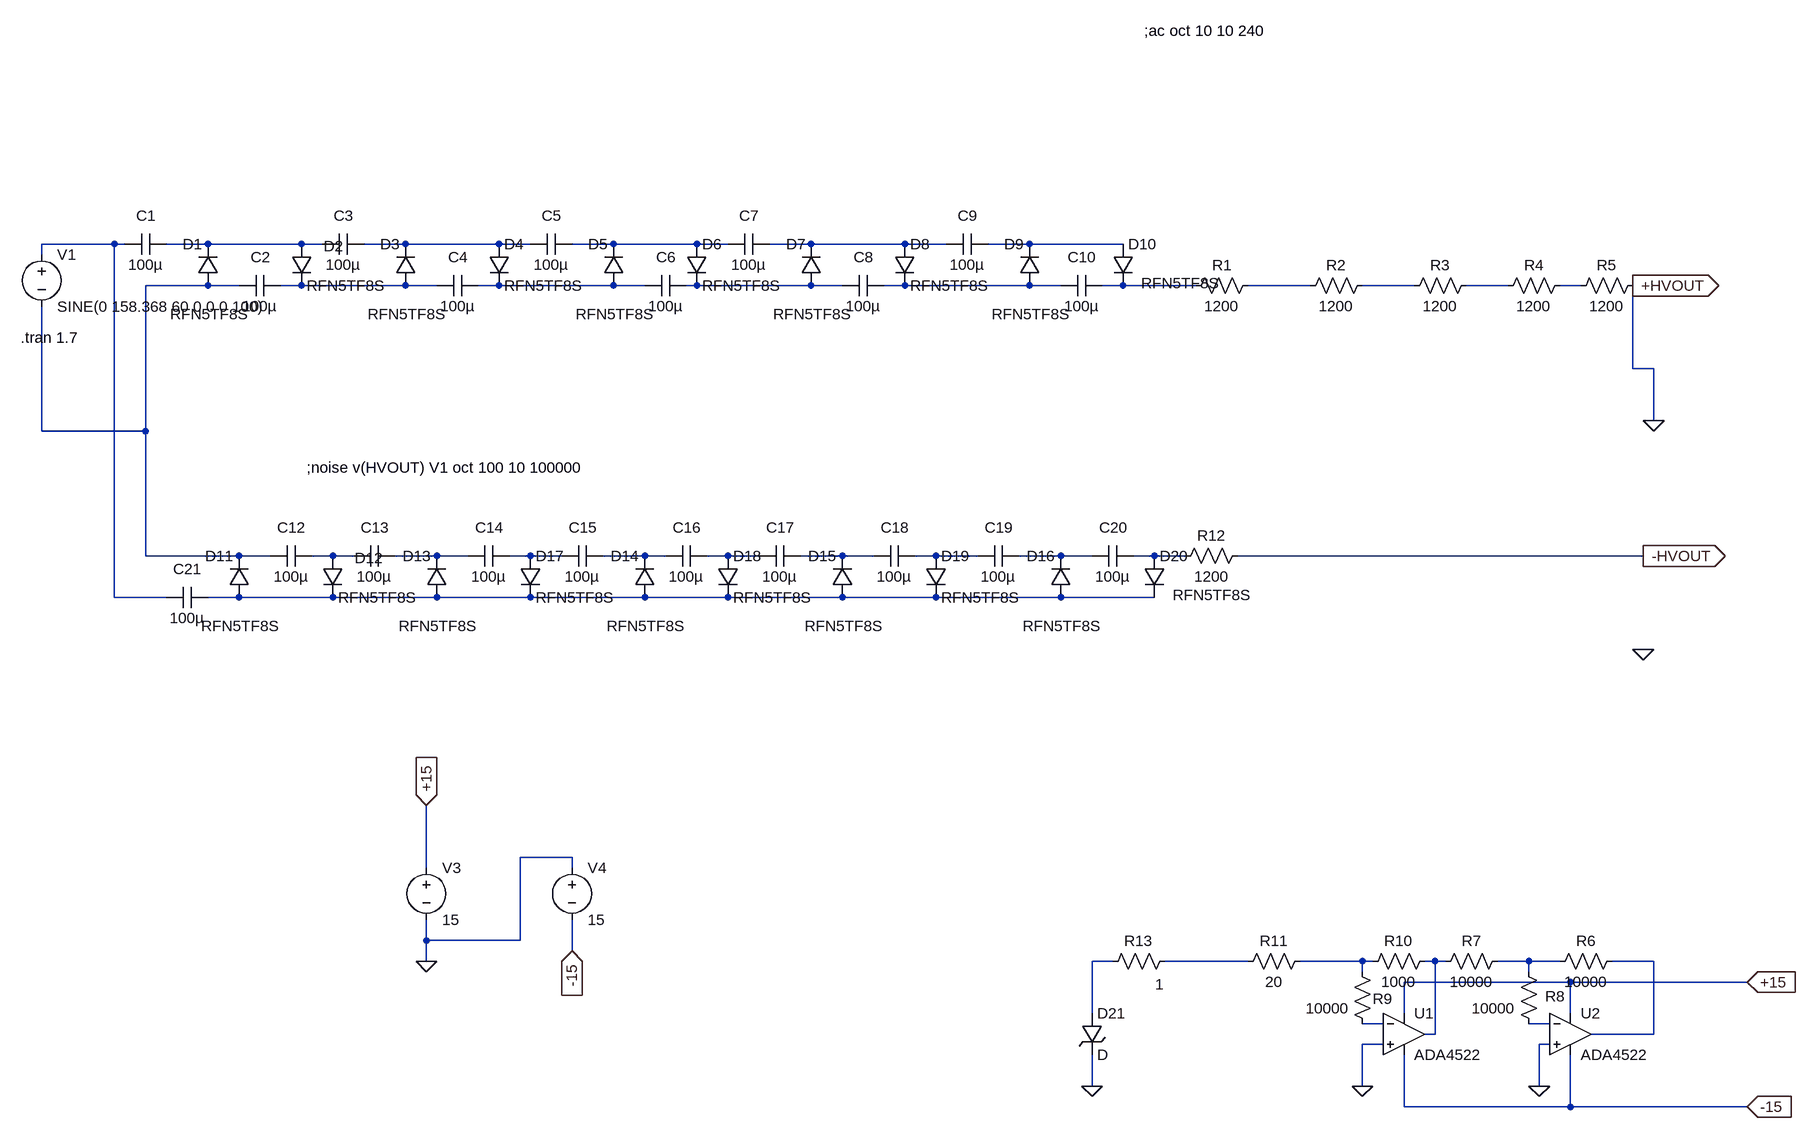
[diagram p0: schematic WALTON COCKROFT MULTIPLIER rev2.asc]
WALTON COCKROFT MULTIPLIER rev2.asc, the LTspice schematic file:
Version 4
SHEET 1 2644 1512
WIRE 32 112 -80 112
WIRE 48 112 32 112
WIRE 176 112 112 112
WIRE 320 112 176 112
WIRE 352 112 320 112
WIRE 480 112 416 112
WIRE 624 112 480 112
WIRE 672 112 624 112
WIRE 800 112 736 112
WIRE 928 112 800 112
WIRE 976 112 928 112
WIRE 1104 112 1040 112
WIRE 1248 112 1104 112
WIRE 1312 112 1248 112
WIRE 1440 112 1376 112
WIRE 1584 112 1440 112
WIRE -80 128 -80 112
WIRE 176 176 80 176
WIRE 224 176 176 176
WIRE 320 176 288 176
WIRE 480 176 320 176
WIRE 528 176 480 176
WIRE 624 176 592 176
WIRE 800 176 624 176
WIRE 848 176 800 176
WIRE 928 176 912 176
WIRE 1104 176 928 176
WIRE 1152 176 1104 176
WIRE 1248 176 1216 176
WIRE 1440 176 1248 176
WIRE 1488 176 1440 176
WIRE 1584 176 1552 176
WIRE 1696 176 1584 176
WIRE 1872 176 1776 176
WIRE 2032 176 1952 176
WIRE 2176 176 2112 176
WIRE 2288 176 2256 176
WIRE 2368 304 2368 176
WIRE 2400 304 2368 304
WIRE 2400 384 2400 304
WIRE -80 400 -80 208
WIRE 80 400 80 176
WIRE 80 400 -80 400
WIRE 80 592 80 400
WIRE 224 592 80 592
WIRE 272 592 224 592
WIRE 368 592 336 592
WIRE 400 592 368 592
WIRE 528 592 464 592
WIRE 576 592 528 592
WIRE 672 592 640 592
WIRE 720 592 672 592
WIRE 848 592 784 592
WIRE 880 592 848 592
WIRE 976 592 944 592
WIRE 1024 592 976 592
WIRE 1152 592 1088 592
WIRE 1200 592 1152 592
WIRE 1296 592 1264 592
WIRE 1360 592 1296 592
WIRE 1488 592 1424 592
WIRE 1536 592 1488 592
WIRE 1632 592 1600 592
WIRE 1680 592 1632 592
WIRE 2384 592 1760 592
WIRE 32 656 32 112
WIRE 112 656 32 656
WIRE 224 656 176 656
WIRE 368 656 224 656
WIRE 528 656 368 656
WIRE 672 656 528 656
WIRE 848 656 672 656
WIRE 976 656 848 656
WIRE 1152 656 976 656
WIRE 1296 656 1152 656
WIRE 1488 656 1296 656
WIRE 1632 656 1488 656
WIRE 736 1056 656 1056
WIRE 512 1072 512 976
WIRE 736 1072 736 1056
WIRE 512 1184 512 1152
WIRE 656 1184 656 1056
WIRE 656 1184 512 1184
WIRE 736 1200 736 1152
WIRE 512 1216 512 1184
WIRE 1568 1216 1536 1216
WIRE 1776 1216 1648 1216
WIRE 1952 1216 1856 1216
WIRE 1968 1216 1952 1216
WIRE 2064 1216 2048 1216
WIRE 2080 1216 2064 1216
WIRE 2208 1216 2160 1216
WIRE 2256 1216 2208 1216
WIRE 2400 1216 2336 1216
WIRE 1952 1232 1952 1216
WIRE 2208 1232 2208 1216
WIRE 2272 1248 2016 1248
WIRE 2544 1248 2272 1248
WIRE 1536 1296 1536 1216
WIRE 2016 1296 2016 1248
WIRE 2272 1296 2272 1248
WIRE 1984 1312 1952 1312
WIRE 2240 1312 2208 1312
WIRE 2064 1328 2064 1216
WIRE 2064 1328 2048 1328
WIRE 2400 1328 2400 1216
WIRE 2400 1328 2304 1328
WIRE 1984 1344 1952 1344
WIRE 2240 1344 2224 1344
WIRE 1536 1408 1536 1360
WIRE 1952 1408 1952 1344
WIRE 2224 1408 2224 1344
WIRE 2016 1440 2016 1360
WIRE 2272 1440 2272 1360
WIRE 2272 1440 2016 1440
WIRE 2544 1440 2272 1440
FLAG 2368 176 +HVOUT
IOPIN 2368 176 Out
FLAG 2400 384 0
FLAG 2384 592 -HVOUT
IOPIN 2384 592 Out
FLAG 2384 736 0
FLAG 2224 1408 0
FLAG 1952 1408 0
FLAG 1536 1408 0
FLAG 2544 1248 +15
IOPIN 2544 1248 In
FLAG 2544 1440 -15
IOPIN 2544 1440 In
FLAG 512 1216 0
FLAG 512 976 +15
IOPIN 512 976 In
FLAG 736 1200 -15
IOPIN 736 1200 In
SYMBOL cap 112 96 R90
WINDOW 0 -12 31 VBottom 2
WINDOW 3 32 32 VTop 2
SYMATTR InstName C1
SYMATTR Value 100µ
SYMATTR SpiceLine V=500 Irms=0 Rser=0.720 Lser=0
SYMBOL diode 192 176 R180
WINDOW 0 24 64 Left 2
WINDOW 3 -48 -44 Left 2
SYMATTR InstName D1
SYMATTR Value RFN5TF8S
SYMBOL cap 288 160 R90
WINDOW 0 -12 31 VBottom 2
WINDOW 3 32 32 VTop 2
SYMATTR InstName C2
SYMATTR Value 100µ
SYMATTR SpiceLine V=500 Irms=0 Rser=0.720 Lser=0
SYMBOL diode 304 112 R0
WINDOW 0 50 3 Left 2
SYMATTR InstName D2
SYMATTR Value RFN5TF8S
SYMBOL cap 416 96 R90
WINDOW 0 -12 31 VBottom 2
WINDOW 3 32 32 VTop 2
SYMATTR InstName C3
SYMATTR Value 100µ
SYMATTR SpiceLine V=500 Irms=0 Rser=0.720 Lser=0
SYMBOL diode 496 176 R180
WINDOW 0 24 64 Left 2
WINDOW 3 -48 -44 Left 2
SYMATTR InstName D3
SYMATTR Value RFN5TF8S
SYMBOL cap 592 160 R90
WINDOW 0 -12 31 VBottom 2
WINDOW 3 32 32 VTop 2
SYMATTR InstName C4
SYMATTR Value 100µ
SYMATTR SpiceLine V=500 Irms=0 Rser=0.720 Lser=0
SYMBOL cap 736 96 R90
WINDOW 0 -12 31 VBottom 2
WINDOW 3 32 32 VTop 2
SYMATTR InstName C5
SYMATTR Value 100µ
SYMATTR SpiceLine V=500 Irms=0 Rser=0.720 Lser=0
SYMBOL diode 816 176 R180
WINDOW 0 24 64 Left 2
WINDOW 3 -48 -44 Left 2
SYMATTR InstName D5
SYMATTR Value RFN5TF8S
SYMBOL cap 912 160 R90
WINDOW 0 -12 31 VBottom 2
WINDOW 3 32 32 VTop 2
SYMATTR InstName C6
SYMATTR Value 100µ
SYMATTR SpiceLine V=500 Irms=0 Rser=0.720 Lser=0
SYMBOL cap 1040 96 R90
WINDOW 0 -12 31 VBottom 2
WINDOW 3 32 32 VTop 2
SYMATTR InstName C7
SYMATTR Value 100µ
SYMATTR SpiceLine V=500 Irms=0 Rser=0.720 Lser=0
SYMBOL diode 1120 176 R180
WINDOW 0 24 64 Left 2
WINDOW 3 -48 -44 Left 2
SYMATTR InstName D7
SYMATTR Value RFN5TF8S
SYMBOL cap 1216 160 R90
WINDOW 0 -12 31 VBottom 2
WINDOW 3 32 32 VTop 2
SYMATTR InstName C8
SYMATTR Value 100µ
SYMATTR SpiceLine V=500 Irms=0 Rser=0.720 Lser=0
SYMBOL cap 1376 96 R90
WINDOW 0 -12 31 VBottom 2
WINDOW 3 32 32 VTop 2
SYMATTR InstName C9
SYMATTR Value 100µ
SYMATTR SpiceLine V=500 Irms=0 Rser=0.720 Lser=0
SYMBOL diode 1456 176 R180
WINDOW 0 24 64 Left 2
WINDOW 3 -48 -44 Left 2
SYMATTR InstName D9
SYMATTR Value RFN5TF8S
SYMBOL cap 1552 160 R90
WINDOW 0 -12 31 VBottom 2
WINDOW 3 32 32 VTop 2
SYMATTR InstName C10
SYMATTR Value 100µ
SYMATTR SpiceLine V=500 Irms=0 Rser=0.720 Lser=0
SYMBOL res 1792 160 R90
WINDOW 0 0 56 VBottom 2
WINDOW 3 32 56 VTop 2
SYMATTR InstName R1
SYMATTR Value 1200
SYMATTR SpiceLine pwr=5
SYMBOL res 1968 160 R90
WINDOW 0 0 56 VBottom 2
WINDOW 3 32 56 VTop 2
SYMATTR InstName R2
SYMATTR Value 1200
SYMATTR SpiceLine pwr=5
SYMBOL res 2128 160 R90
WINDOW 0 0 56 VBottom 2
WINDOW 3 32 56 VTop 2
SYMATTR InstName R3
SYMATTR Value 1200
SYMATTR SpiceLine pwr=5
SYMBOL res 2272 160 R90
WINDOW 0 0 56 VBottom 2
WINDOW 3 32 56 VTop 2
SYMATTR InstName R4
SYMATTR Value 1200
SYMATTR SpiceLine pwr=5
SYMBOL res 2384 160 R90
WINDOW 0 0 56 VBottom 2
WINDOW 3 32 56 VTop 2
SYMATTR InstName R5
SYMATTR Value 1200
SYMATTR SpiceLine pwr=5
SYMBOL voltage -80 112 R0
WINDOW 123 0 0 Left 2
WINDOW 39 0 0 Left 2
SYMATTR InstName V1
SYMATTR Value SINE(0 158.368 60 0 0 0 100)
SYMBOL diode 608 112 R0
SYMATTR InstName D4
SYMATTR Value RFN5TF8S
SYMBOL diode 912 112 R0
SYMATTR InstName D6
SYMATTR Value RFN5TF8S
SYMBOL diode 1232 112 R0
SYMATTR InstName D8
SYMATTR Value RFN5TF8S
SYMBOL diode 1568 112 R0
WINDOW 3 44 60 Left 2
SYMATTR Value RFN5TF8S
SYMATTR InstName D10
SYMBOL diode 240 656 R180
WINDOW 0 24 64 Left 2
WINDOW 3 -48 -44 Left 2
SYMATTR InstName D11
SYMATTR Value RFN5TF8S
SYMBOL cap 336 576 R90
WINDOW 0 -12 31 VBottom 2
WINDOW 3 32 32 VTop 2
SYMATTR InstName C12
SYMATTR Value 100µ
SYMATTR SpiceLine V=500 Irms=0 Rser=0.720 Lser=0
SYMBOL diode 352 592 R0
WINDOW 0 50 3 Left 2
SYMATTR InstName D12
SYMATTR Value RFN5TF8S
SYMBOL cap 464 576 R90
WINDOW 0 -12 31 VBottom 2
WINDOW 3 32 32 VTop 2
SYMATTR InstName C13
SYMATTR Value 100µ
SYMATTR SpiceLine V=500 Irms=0 Rser=0.720 Lser=0
SYMBOL diode 544 656 R180
WINDOW 0 24 64 Left 2
WINDOW 3 -48 -44 Left 2
SYMATTR InstName D13
SYMATTR Value RFN5TF8S
SYMBOL cap 640 576 R90
WINDOW 0 -12 31 VBottom 2
WINDOW 3 32 32 VTop 2
SYMATTR InstName C14
SYMATTR Value 100µ
SYMATTR SpiceLine V=500 Irms=0 Rser=0.720 Lser=0
SYMBOL cap 784 576 R90
WINDOW 0 -12 31 VBottom 2
WINDOW 3 32 32 VTop 2
SYMATTR InstName C15
SYMATTR Value 100µ
SYMATTR SpiceLine V=500 Irms=0 Rser=0.720 Lser=0
SYMBOL diode 864 656 R180
WINDOW 0 24 64 Left 2
WINDOW 3 -48 -44 Left 2
SYMATTR InstName D14
SYMATTR Value RFN5TF8S
SYMBOL cap 944 576 R90
WINDOW 0 -12 31 VBottom 2
WINDOW 3 32 32 VTop 2
SYMATTR InstName C16
SYMATTR Value 100µ
SYMATTR SpiceLine V=500 Irms=0 Rser=0.720 Lser=0
SYMBOL cap 1088 576 R90
WINDOW 0 -12 31 VBottom 2
WINDOW 3 32 32 VTop 2
SYMATTR InstName C17
SYMATTR Value 100µ
SYMATTR SpiceLine V=500 Irms=0 Rser=0.720 Lser=0
SYMBOL diode 1168 656 R180
WINDOW 0 24 64 Left 2
WINDOW 3 -48 -44 Left 2
SYMATTR InstName D15
SYMATTR Value RFN5TF8S
SYMBOL cap 1264 576 R90
WINDOW 0 -12 31 VBottom 2
WINDOW 3 32 32 VTop 2
SYMATTR InstName C18
SYMATTR Value 100µ
SYMATTR SpiceLine V=500 Irms=0 Rser=0.720 Lser=0
SYMBOL cap 1424 576 R90
WINDOW 0 -12 31 VBottom 2
WINDOW 3 32 32 VTop 2
SYMATTR InstName C19
SYMATTR Value 100µ
SYMATTR SpiceLine V=500 Irms=0 Rser=0.720 Lser=0
SYMBOL diode 1504 656 R180
WINDOW 0 24 64 Left 2
WINDOW 3 -48 -44 Left 2
SYMATTR InstName D16
SYMATTR Value RFN5TF8S
SYMBOL cap 1600 576 R90
WINDOW 0 -12 31 VBottom 2
WINDOW 3 32 32 VTop 2
SYMATTR InstName C20
SYMATTR Value 100µ
SYMATTR SpiceLine V=500 Irms=0 Rser=0.720 Lser=0
SYMBOL diode 656 592 R0
SYMATTR InstName D17
SYMATTR Value RFN5TF8S
SYMBOL diode 960 592 R0
SYMATTR InstName D18
SYMATTR Value RFN5TF8S
SYMBOL diode 1280 592 R0
SYMATTR InstName D19
SYMATTR Value RFN5TF8S
SYMBOL diode 1616 592 R0
WINDOW 3 44 60 Left 2
SYMATTR Value RFN5TF8S
SYMATTR InstName D20
SYMBOL cap 176 640 R90
WINDOW 0 -12 31 VBottom 2
WINDOW 3 32 32 VTop 2
SYMATTR InstName C21
SYMATTR Value 100µ
SYMATTR SpiceLine V=500 Irms=0 Rser=0.720 Lser=0
SYMBOL res 1776 576 R90
WINDOW 0 0 56 VBottom 2
WINDOW 3 32 56 VTop 2
SYMATTR InstName R12
SYMATTR Value 1200
SYMATTR SpiceLine pwr=5
SYMBOL Opamps\\ADA4522 2016 1264 R0
SYMATTR InstName U1
SYMBOL Opamps\\ADA4522 2272 1264 R0
SYMATTR InstName U2
SYMBOL res 2352 1200 R90
WINDOW 0 0 56 VBottom 2
WINDOW 3 32 56 VTop 2
SYMATTR InstName R6
SYMATTR Value 10000
SYMATTR SpiceLine tol=0.01
SYMBOL res 2176 1200 R90
WINDOW 0 0 56 VBottom 2
WINDOW 3 32 56 VTop 2
SYMATTR InstName R7
SYMATTR Value 10000
SYMATTR SpiceLine tol=.01
SYMBOL res 2224 1328 R180
WINDOW 0 -40 58 Left 2
WINDOW 3 36 40 Left 2
SYMATTR InstName R8
SYMATTR Value 10000
SYMATTR SpiceLine tol=.01
SYMBOL res 1968 1328 R180
WINDOW 0 -31 54 Left 2
WINDOW 3 36 40 Left 2
SYMATTR InstName R9
SYMATTR Value 10000
SYMATTR SpiceLine tol=.01
SYMBOL res 2064 1200 R90
WINDOW 0 0 56 VBottom 2
WINDOW 3 32 56 VTop 2
SYMATTR InstName R10
SYMATTR Value 1000
SYMATTR SpiceLine tol=.01
SYMBOL res 1872 1200 R90
WINDOW 0 0 56 VBottom 2
WINDOW 3 32 56 VTop 2
SYMATTR InstName R11
SYMATTR Value 20
SYMBOL res 1664 1200 R90
WINDOW 0 0 56 VBottom 2
WINDOW 3 36 24 VTop 2
SYMATTR InstName R13
SYMATTR Value 1
SYMATTR SpiceLine tol=.01
SYMBOL TVSdiode 1520 1296 R0
SYMATTR InstName D21
SYMBOL voltage 512 1056 R0
WINDOW 123 0 0 Left 2
WINDOW 39 0 0 Left 2
SYMATTR InstName V3
SYMATTR Value 15
SYMBOL voltage 736 1056 R0
WINDOW 123 0 0 Left 2
WINDOW 39 0 0 Left 2
SYMATTR InstName V4
SYMATTR Value 15
TEXT -112 256 Left 2 !.tran 1.7
TEXT 1616 -216 Left 2 !;ac oct 10 10 240
TEXT 328 456 Left 2 !;noise v(HVOUT) V1 oct 100 10 100000

The netlist it stands for:
* WALTON COCKROFT MULTIPLIER rev2.asc
C1 N002 N001 100µ V=500 Irms=0 Rser=0.720 Lser=0
D1 N007 N002 RFN5TF8S
C2 N008 N007 100µ V=500 Irms=0 Rser=0.720 Lser=0
D2 N002 N008 RFN5TF8S
C3 N003 N002 100µ V=500 Irms=0 Rser=0.720 Lser=0
D3 N008 N003 RFN5TF8S
C4 N009 N008 100µ V=500 Irms=0 Rser=0.720 Lser=0
C5 N004 N003 100µ V=500 Irms=0 Rser=0.720 Lser=0
D5 N009 N004 RFN5TF8S
C6 N010 N009 100µ V=500 Irms=0 Rser=0.720 Lser=0
C7 N005 N004 100µ V=500 Irms=0 Rser=0.720 Lser=0
D7 N010 N005 RFN5TF8S
C8 N011 N010 100µ V=500 Irms=0 Rser=0.720 Lser=0
C9 N006 N005 100µ V=500 Irms=0 Rser=0.720 Lser=0
D9 N011 N006 RFN5TF8S
C10 N012 N011 100µ V=500 Irms=0 Rser=0.720 Lser=0
R1 N013 N012 1200 pwr=5
R2 N014 N013 1200 pwr=5
R3 N015 N014 1200 pwr=5
R4 N016 N015 1200 pwr=5
R5 0 N016 1200 pwr=5
V1 N001 N007 SINE(0 158.368 60 0 0 0 100)
D4 N003 N009 RFN5TF8S
D6 N004 N010 RFN5TF8S
D8 N005 N011 RFN5TF8S
D10 N006 N012 RFN5TF8S
D11 N026 N007 RFN5TF8S
C12 N017 N007 100µ V=500 Irms=0 Rser=0.720 Lser=0
D12 N017 N026 RFN5TF8S
C13 N018 N017 100µ V=500 Irms=0 Rser=0.720 Lser=0
D13 N026 N018 RFN5TF8S
C14 N019 N018 100µ V=500 Irms=0 Rser=0.720 Lser=0
C15 N020 N019 100µ V=500 Irms=0 Rser=0.720 Lser=0
D14 N026 N020 RFN5TF8S
C16 N021 N020 100µ V=500 Irms=0 Rser=0.720 Lser=0
C17 N022 N021 100µ V=500 Irms=0 Rser=0.720 Lser=0
D15 N026 N022 RFN5TF8S
C18 N023 N022 100µ V=500 Irms=0 Rser=0.720 Lser=0
C19 N024 N023 100µ V=500 Irms=0 Rser=0.720 Lser=0
D16 N026 N024 RFN5TF8S
C20 N025 N024 100µ V=500 Irms=0 Rser=0.720 Lser=0
D17 N019 N026 RFN5TF8S
D18 N021 N026 RFN5TF8S
D19 N023 N026 RFN5TF8S
D20 N025 N026 RFN5TF8S
C21 N026 N001 100µ V=500 Irms=0 Rser=0.720 Lser=0
R12 -HVOUT N025 1200 pwr=5
XU1 0 N033 +15 -15 N030 ADA4522  ; pins In+ In- V+ V- OUT
XU2 0 N034 +15 -15 N032 ADA4522  ; pins In+ In- V+ V- OUT
R6 N032 N031 10000 tol=0.01
R7 N031 N030 10000 tol=.01
R8 N034 N031 10000 tol=.01
R9 N033 N029 10000 tol=.01
R10 N030 N029 1000 tol=.01
R11 N029 N028 20
R13 N028 N027 1 tol=.01
D21 N027 0 D
V3 +15 0 15
V4 0 -15 15
.model D D
.lib standard.dio
.tran 1.7
;ac oct 10 10 240
;noise v(HVOUT) V1 oct 100 10 100000
.backanno
.end